# Altium project Comparator.PrjPCB
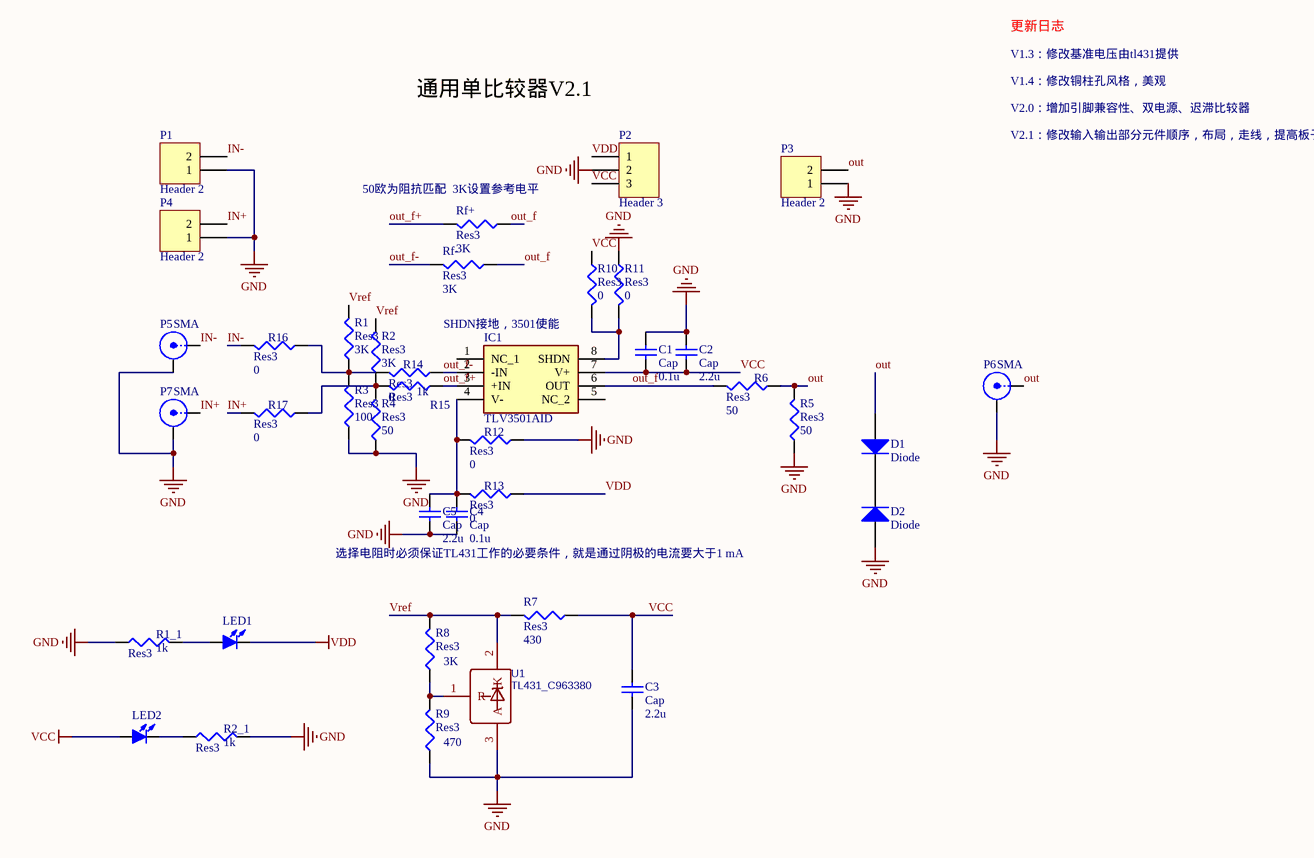
[diagram p0: Comparator.SchDoc]
1 sheet, 39 parts. Net scope: global (net labels, ports and power ports of the same name join across sheets).
Board files: Comparator.PcbDoc, Comparator2.0.PcbDoc

## Sheet Comparator.SchDoc
size A2; Organization: Altium Limited; Address1: L3, 12a Rodborough Rd; Address2: Frenchs Forest; Address3: NSW; Address4: Australia 2086

### Parts
C1  Cap  value 0.1u  [0805D]
C2  Cap  value 2.2u  [0805D]
C3  Cap  value 2.2u  [0805D]
C4  Cap  value 0.1u  [0805D]
C5  Cap  value 2.2u  [0805D]
D1  Diode  [1206A]
D2  Diode  [1206A]
IC1  TLV3501AID  [SOIC127P600X175-8N]
LED1  (no value)  [0805D]
LED2  (no value)  [0805D]
P1  Header 2  [HDR1X2]
P2  Header 3  [HDR1X3]
P3  Header 2  [HDR1X2]
P4  Header 2  [HDR1X2]
P5  SMA  [SMA1]
P6  SMA  [SMA1]
P7  SMA  [SMA1]
R1  Res3  value 3K  [0805D]
R1_1  Res3  value 1k  [0805D]
R2  Res3  value 3K  [0805D]
R2_1  Res3  value 1k  [0805D]
R3  Res3  value 100  [0805D]
R4  Res3  value 50  [0805D]
R5  Res3  value 50  [0805D]
R6  Res3  value 50  [0805D]
R7  Res3  value 430  [0805D]
R8  Res3  value 3K  [0805D]
R9  Res3  value 470  [0805D]
R10  Res3  value 0  [0805D]
R11  Res3  value 0  [0805D]
R12  Res3  value 0  [0805D]
R13  Res3  value 0  [0805D]
R14  Res3  value 0  [0805D]
R15  Res3  value 1k  [0805D]
R16  Res3  value 0  [0805D]
R17  Res3  value 0  [0805D]
Rf+  Res3  value 3K  [0805D]
Rf-  Res3  value 3K  [0805D]
U1  TL431_C963380  [SOT-23]

### Nets
GND: C1.2 C2.2 C3.1 C4.2 C5.1 D2.1(A) P1.1 P2.2 P3.1 P4.1 P5.2(Y) P6.2(Y) P7.2(Y) R1_1.1 R2_1.2 R3.1 R4.1 R5.1 R9.1 R11.1 R12.1 U1.3(A)
VCC: C1.1 C2.1 C3.2 IC1.7(V+) LED2.1(A) P2.3 R7.1 R10.1
VDD: LED1.2(K) P2.1 R13.1
IN+: P4.2 P7.1(X) R17.2
IN-: P1.2 P5.1(X) R16.2
out: D1.1(A) P3.2 P6.1(X) R5.2 R6.1
out_f: IC1.6(OUT) R6.2 Rf+.1 Rf-.1
out_f+: IC1.3(+IN) R15.1 Rf+.2
out_f-: IC1.2(-IN) R14.1 Rf-.2
Vref: R1.2 R2.2 R7.2 R8.2 U1.2(K)
NetC4_1: C4.1 C5.2 IC1.4(V-) R12.2 R13.2
NetD1_2: D1.2(K) D2.2(K)
NetIC1_8: IC1.8(SHDN) R10.2 R11.2
NetLED1_1: LED1.1(A) R1_1.2
NetLED2_2: LED2.2(K) R2_1.1
NetR1_1: R1.1 R3.2 R14.2 R16.1
NetR2_1: R2.1 R4.2 R15.2 R17.1
NetR8_1: R8.1 R9.2 U1.1(R)

Not connected (* = marked no-connect by the designer): IC1 1(NC_1) 5(NC_2)

### Notes on the sheet
- V1.3：修改基准电压由tl431提供
- 更新日志
- 通用单比较器V2.1
- V1.4：修改铜柱孔风格，美观
- V2.0：增加引脚兼容性、双电源、迟滞比较器
- (near Rf+) 50欧为阻抗匹配  3K设置参考电平
- V2.1：修改输入输出部分元件顺序，布局，走线，提高板子脉冲输出特性，增加电源指示灯
- SHDN接地，3501使能
- 选择电阻时必须保证TL431工作的必要条件，就是通过阴极的电流要大于1 mA
- Title
- Size:
- Date:
- File:
- A2
- Number:
- Time:
- Revision:
- Sheet
- of

### Library data of the parts
C1-C5 = Cap: Capacitor; Published: 8-Jun-2000; LatestRevisionDate: 17-Jul-2002; LatestRevisionNote: Re-released for DXP Platform.; PackageReference: RAD-0.3; Publisher: Altium Limited; PackageDescription: Radial Cap, Thru-Hole; 2 Leads; 0.3 in Pin Spacing
D1 D2 = Diode: Default Diode; Published: 8-Jun-2000; LatestRevisionDate: 17-Jul-2002; LatestRevisionNote: Re-released for DXP Platform.; PackageVersion: Sep-1996; PackageReference: SMC; Publisher: Altium Limited; PackageDescription: DO-214-AB/SMC; 2 C-Bend Leads; Body 7.9 x 5.9 mm, inc. leads (LxW); Code_JEDEC: DO-214-AB
IC1 = TLV3501AID: Integrated Circuit; Manufacturer_Name: Texas Instruments; Datasheet Link: http://www.ti.com/lit/ds/symlink/tlv3501.pdf; Height: 1.75mm; Manufacturer_Part_Number: TLV3501AID; Mouser Part Number: 595-TLV3501AID; Mouser Price/Stock: https://www.mouser.co.uk/ProductDetail/Texas-Instruments/TLV3501AID?qs=m96fseALk3X7x6f01EkGWg%3D%3D; Arrow Part Number: TLV3501AID; Arrow Price/Stock: https://www.arrow.com/en/products/tlv3501aid/texas-instruments
LED1 LED2 = LED-SMD: 贴片LED; 版权归属: 源创客; BOM名称: 贴片LED; 学习资源: www.ooocke.com
P1 P3 P4 = Header 2: Header, 2-Pin; LatestRevisionDate: 17-Jul-2002; LatestRevisionNote: Re-released for DXP Platform.; Publisher: Altium Limited
P2 = Header 3: Header, 3-Pin; LatestRevisionDate: 17-Jul-2002; LatestRevisionNote: Re-released for DXP Platform.; Publisher: Altium Limited
P5-P7 = BNC: BNC Elbow Connector; LatestRevisionDate: 17-Jul-2002; LatestRevisionNote: Re-released for DXP Platform.; Publisher: Altium Limited
R1 R1_1 R2 R2_1 R3-R17 Rf+ Rf- = Res3: Resistor; Published: 8-Jun-2000; LatestRevisionDate: 29-May-2009; LatestRevisionNote: IPC-7351 Footprint Added.; PackageReference: J1-0603; Publisher: Altium Limited; PackageDescription: Chip Resistor
U1 = TL431: pin to pad: 1>B 2>E 3>C; BOM_Manufacturer: JSMSEMI; Contributor: LCSC; BOM_Supplier: LCSC; BOM_Supplier Part: C963380; BOM_Manufacturer Part: TL431; spicePre: U; spiceSymbolName: TL431_C963380